# Altium schematic sheet PCF8547.SchDoc
size A; SheetNumber: 12; SheetTotal: 12
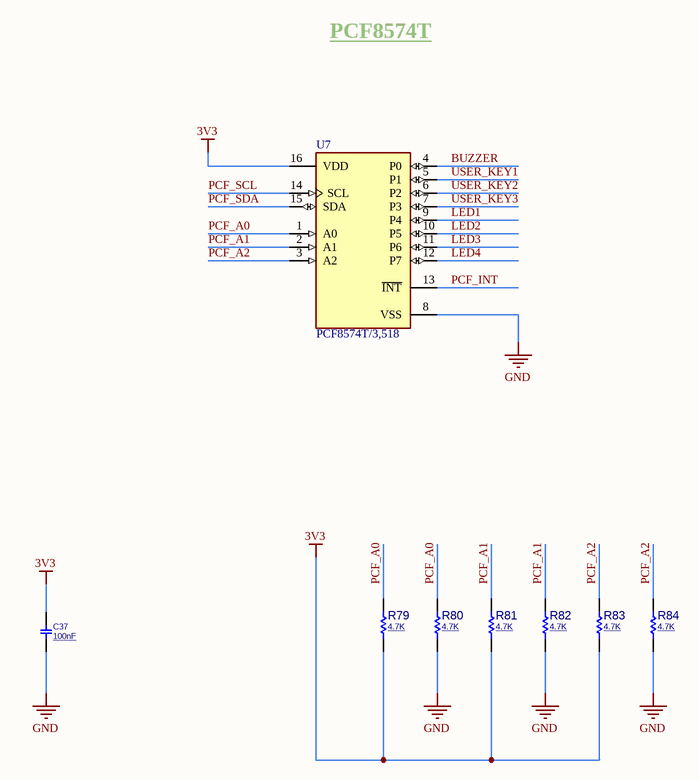
[diagram p0: PCF8547.SchDoc]

## Parts
C37  100nF  [C0603]
R79  4.7K  [R0603]
R80  4.7K  [R0603]
R81  4.7K  [R0603]
R82  4.7K  [R0603]
R83  4.7K  [R0603]
R84  4.7K  [R0603]
U7  PCF8574T/3,518  [FP-SOT162-1-MFG]

## Nets
3V3: C37.2 R79.2 R81.2 R83.2 U7.16(VDD)
GND: C37.1 R80.2 R82.2 R84.2 U7.8(VSS)
BUZZER: U7.4(P0)
LED1: U7.9(P4)
LED2: U7.10(P5)
LED3: U7.11(P6)
LED4: U7.12(P7)
PCF_A0: R79.1 R80.1 U7.1(A0)
PCF_A1: R81.1 R82.1 U7.2(A1)
PCF_A2: R83.1 R84.1 U7.3(A2)
PCF_INT: U7.13(~{INT})
PCF_SCL: U7.14(SCL)
PCF_SDA: U7.15(SDA)
USER_KEY1: U7.5(P1)
USER_KEY2: U7.6(P2)
USER_KEY3: U7.7(P3)

## Notes on the sheet
- PCF8574T

## Library data of the parts
C37 = CAP_SMD_MLCC_0603: CAP, MLCC, -F, -V, MATERIAL, -%, 0201; PARAM: -, -%; MANF_P#: MANF_PART#; PRICE: 100= 1$; MANF: -; PARAM2: -V; ASSEMBLY: ASSEMBLY; VALUE: 100nF
R79-R84 = RES_SMD: RESISTOR, SMD; PARAM: -W; DESC: DESCRIPTION; DIST#: MOUSER; PARAM2: 1%; MANF_P#: -; MANF: -; ASSEMBLY: ASSEMBLY; PRICE: 100= 0.5$; VALUE: 4.7K
U7 = PCF8574T: IC I/O EXPANDER I2C 8B 16SOIC; Manufacturer: NXP Semiconductors; Frequency: 100kHz; Max Supply Voltage: 6V; Standoff Height: 0.1mm; Nominal Supply Current: 40uA; Max Junction Temp: +125°C; Min Supply Voltage: 2.5V; Number Of I/Os: 8; Manufacturer Part Number: PCF8574T/3,518; Footprint Url: https://www.nxp.com/docs/en/package-information/SOT162-1.pdf; ComponentLink2URL: https://www.nxp.com/docs/en/data-sheet/PCF8574_PCF8574A.pdf; Automotive: No; Digikey Description: IC I/O EXPANDER I2C 8B 16SOIC; Mouser Description: PCF8574 Series 2.5 - 6V Remote 8-bit I/O Expander for I2C-bus - SOIC-16; Ipc Land Pattern Name: SOIC127P1032X265-16; Interface: I2C; Octopart: https://octopart.com/pcf8574t%2F3%2C518-nxp+semiconductors-10470852; Ambient Temperature Range Low: -40°C; Lead Free: Yes; Device Class L2: Interface ICs; Temperature Range High: +85°C; Device Class L1: Integrated Circuits (ICs); Package: SOT162-1; ComponentLink2Description: Datasheet; Device Class L3: I/O Expanders; Temperature: -40°C to +85°C; Ambient Temperature Range High: +85°C; Height: 2.65mm; Category: IC; RoHS: TRUE; Temperature Range Low: -40°C